# Altium project tanekonsat2022_auto.PrjPcb
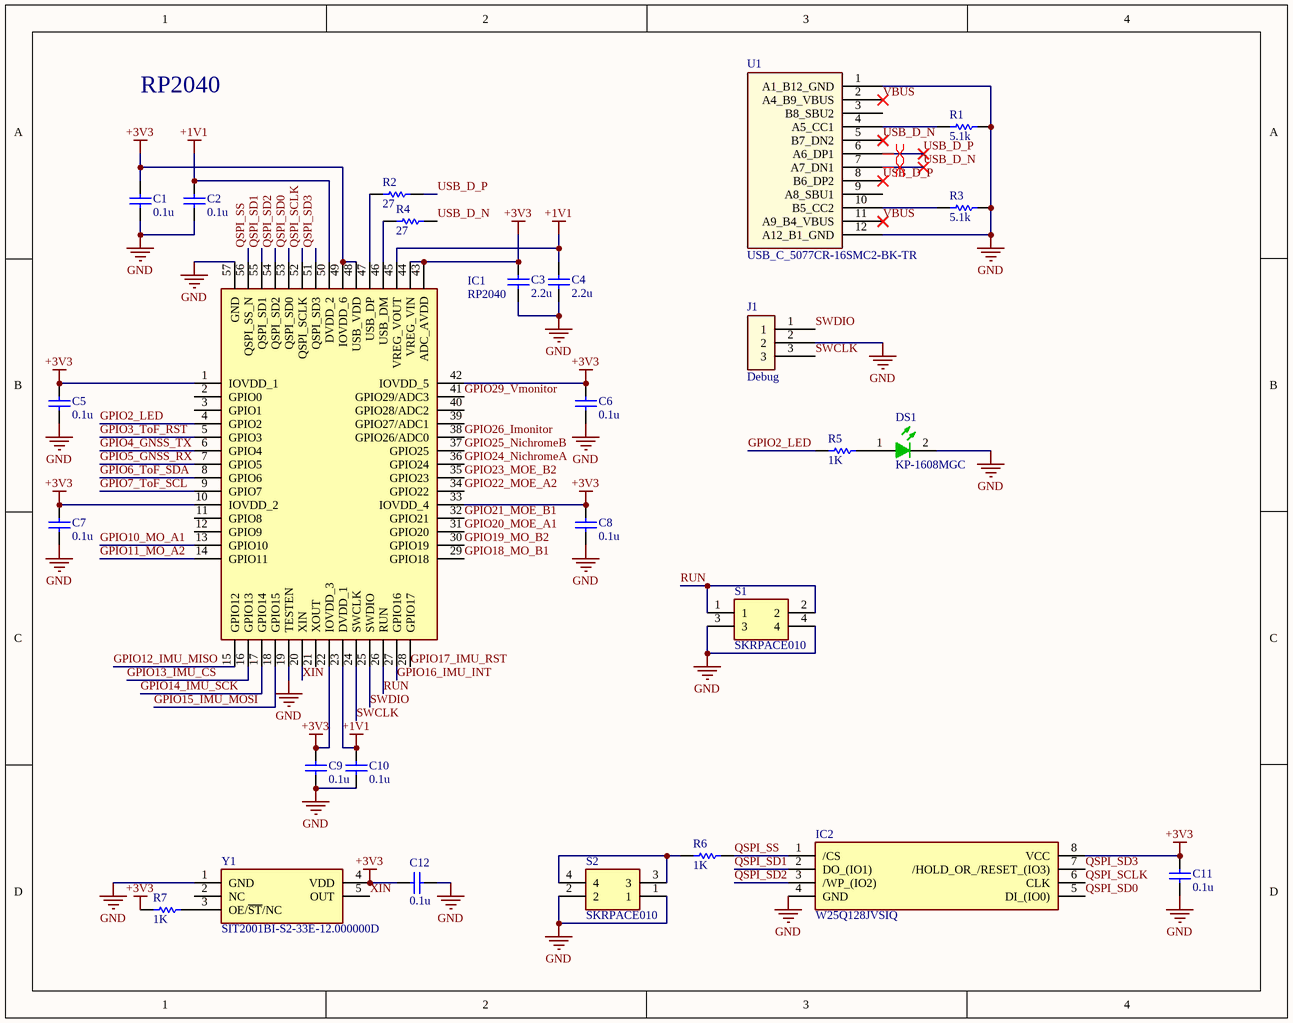
[diagram p0: RP2040_Conn.SchDoc]
3 sheets, 81 parts. Net scope: global (net labels, ports and power ports of the same name join across sheets).
Board file: EM2_PCB.PcbDoc
Sheets:
  RP2040_Conn.SchDoc
  IMU_Motor.SchDoc
  Power_Nichrome.SchDoc

## Sheet RP2040_Conn.SchDoc: Prometheus
size A; DrawnBy: Akio M; Organization: DERC CanSat PJ; Revision: 1; SheetNumber: 1; SheetTotal: 3

### Parts
C1  value 0.1u  [1608[0603]]  (hidden comment: Capacitor)
C2  value 0.1u  [1608[0603]]  (hidden comment: Capacitor)
C3  value 2.2u  [1608[0603]]  (hidden comment: Capacitor)
C4  value 2.2u  [1608[0603]]  (hidden comment: Capacitor)
C5  value 0.1u  [1608[0603]]  (hidden comment: Capacitor)
C6  value 0.1u  [1608[0603]]  (hidden comment: Capacitor)
C7  value 0.1u  [1608[0603]]  (hidden comment: Capacitor)
C8  value 0.1u  [1608[0603]]  (hidden comment: Capacitor)
C9  value 0.1u  [1608[0603]]  (hidden comment: Capacitor)
C10  value 0.1u  [1608[0603]]  (hidden comment: Capacitor)
C11  value 0.1u  [1608[0603]]  (hidden comment: Capacitor)
C12  value 0.1u  [1608[0603]]  (hidden comment: Capacitor)
DS1  KP-1608MGC  [KING-0603LED_GREEN_V]
IC1  RP2040  [QFN40P700X700X90-57N-D]
IC2  W25Q128JVSIQ  [SOIC127P790X216-8N]
J1  Debug  [PinHeader_0.65_3_Half]
R1  value 5.1k  [1608[0603]]  (hidden comment: Resistor)
R2  value 27  [1608[0603]]  (hidden comment: Resistor)
R3  value 5.1k  [1608[0603]]  (hidden comment: Resistor)
R4  value 27  [1608[0603]]  (hidden comment: Resistor)
R5  value 1K  [1608[0603]]  (hidden comment: Resistor)
R6  value 1K  [1608[0603]]  (hidden comment: Resistor)
R7  value 1K  [1608[0603]]  (hidden comment: Resistor)
S1  SKRPACE010  [SMT(4.2X3.2)]
S2  SKRPACE010  [SMT(4.2X3.2)]
U1  USB_C_5077CR-16SMC2-BK-TR  [USB_C_5077CR-16SMC2-BK-TR]
Y1  SIT2001BI-S2-33E-12.000000D  [SOT95P280X145-5N]

### Nets
+1V1: C2.2 C4.2 C10.1 IC1.23(DVDD_1) IC1.45(VREG_VOUT) IC1.50(DVDD_2)
+3V3: C1.2 C3.2 C5.2 C6.1 C7.1 C8.1 C9.1 C11.2 C12.1 IC1.1(IOVDD_1) IC1.10(IOVDD_2) IC1.22(IOVDD_3) IC1.33(IOVDD_4) IC1.42(IOVDD_5) IC1.43(ADC_AVDD) IC1.44(VREG_VIN) IC1.48(USB_VDD) IC1.49(IOVDD_6) IC2.8(VCC) R7.1 Y1.4(VDD)
GND: C1.1 C2.1 C3.1 C4.1 C5.1 C6.2 C7.2 C8.2 C9.2 C10.2 C11.1 C12.2 DS1.2(K) IC1.19(TESTEN) IC1.57(GND) IC2.4(GND) J1.2 R1.2 R3.2 S1.3 S1.4 S2.1 S2.2 U1.1(A1_B12_GND) U1.12(A12_B1_GND) Y1.1(GND)
GPIO2_LED: IC1.4(GPIO2) R5.1
GPIO3_ToF_RST: IC1.5(GPIO3)
GPIO4_GNSS_TX: IC1.6(GPIO4)
GPIO5_GNSS_RX: IC1.7(GPIO5)
GPIO6_ToF_SDA: IC1.8(GPIO6)
GPIO7_ToF_SCL: IC1.9(GPIO7)
GPIO10_MO_A1: IC1.13(GPIO10)
GPIO11_MO_A2: IC1.14(GPIO11)
GPIO12_IMU_MISO: IC1.15(GPIO12)
GPIO13_IMU_CS: IC1.16(GPIO13)
GPIO14_IMU_SCK: IC1.17(GPIO14)
GPIO15_IMU_MOSI: IC1.18(GPIO15)
GPIO16_IMU_INT: IC1.27(GPIO16)
GPIO17_IMU_RST: IC1.28(GPIO17)
GPIO18_MO_B1: IC1.29(GPIO18)
GPIO19_MO_B2: IC1.30(GPIO19)
GPIO20_MOE_A1: IC1.31(GPIO20)
GPIO21_MOE_B1: IC1.32(GPIO21)
GPIO22_MOE_A2: IC1.34(GPIO22)
GPIO23_MOE_B2: IC1.35(GPIO23)
GPIO24_NichromeA: IC1.36(GPIO24)
GPIO25_NichromeB: IC1.37(GPIO25)
GPIO26_Imonitor: IC1.38(GPIO26/ADC0)
GPIO29_Vmonitor: IC1.41(GPIO29/ADC3)
QSPI_SCLK: IC1.52(QSPI_SCLK) IC2.6(CLK)
QSPI_SD0: IC1.53(QSPI_SD0) IC2.5(DI_(IO0))
QSPI_SD1: IC1.55(QSPI_SD1) IC2.2(DO_(IO1))
QSPI_SD2: IC1.54(QSPI_SD2) IC2.3(/WP_(IO2))
QSPI_SD3: IC1.51(QSPI_SD3) IC2.7(/HOLD_OR_/RESET_(IO3))
QSPI_SS: IC1.56(QSPI_SS_N) IC2.1(/CS) R6.2
RUN: IC1.26(RUN) S1.1 S1.2
SWCLK: IC1.24(SWCLK) J1.3
SWDIO: IC1.25(SWDIO) J1.1
USB_D_N: R4.2 U1.5(B7_DN2) U1.7(A7_DN1)
USB_D_P: R2.2 U1.6(A6_DP1) U1.8(B6_DP2)
VBUS: U1.2(A4_B9_VBUS) U1.11(A9_B4_VBUS)
XIN: IC1.20(XIN) Y1.5(OUT)
NetDS1_1: DS1.1(A) R5.2
NetIC1_46: IC1.46(USB_DM) R4.1
NetIC1_47: IC1.47(USB_DP) R2.1
NetR1_1: R1.1 U1.4(A5_CC1)
NetR3_1: R3.1 U1.10(B5_CC2)
NetR6_1: R6.1 S2.3 S2.4
NetR7_2: R7.2 Y1.3(OE/~{ST}/NC)

Not connected (* = marked no-connect by the designer): IC1 2(GPIO0) 3(GPIO1) 11(GPIO8) 12(GPIO9) 21(XOUT) 39(GPIO27/ADC1) 40(GPIO28/ADC2); U1 3(B8_SBU2) 9(A8_SBU1); Y1 2(NC)

### Layout directives
differential pair: USB_D_N, USB_D_P

### Notes on the sheet
- RP2040

### Library data of the parts
C1-C12 = Capacitor: SimulationGenericComponent: True
DS1 = CMP-0404-00001-1: LED, SMT, 0603(1608), 1.1mm thickness, Green; Manufacturer: Kingbright; Reverse Voltage: 5 V; Power Dissipation: 75 mW; Forward Current: 30 mA; Packing Type: 2000 pcs / reel; Mounting Technology: Surface Mount; Storage Temperature: -40 to +85 degC; ComponentLink1URL: http://www.kingbright.com/; PackageDescription: 2-Pin SMT LED, 1.6 x 0.8 mm Pitch; PartNumber: KP-1608MGC; PackageReference: 0603LED_GREEN; ComponentLink1Description: Manufacturer URL
IC1 = RP2040: Integrated Circuit; Manufacturer_Name: RASPBERRY-PI; Datasheet Link: https://datasheets.raspberrypi.org/rp2040/rp2040-datasheet.pdf; Height: 0.9mm; Manufacturer_Part_Number: RP2040
IC2 = W25Q128JVSIQ: Integrated Circuit; Manufacturer_Name: Winbond; Datasheet Link: https://www.winbond.com/hq/search-resource-file.jsp?partNo=W25Q128JVSIQ&type=datasheet; Height: 2.16mm; Manufacturer_Part_Number: W25Q128JVSIQ; Mouser Part Number: 454-W25Q128JVSIQ; Mouser Price/Stock: https://www.mouser.co.uk/ProductDetail/Winbond/W25Q128JVSIQ?qs=qSfuJ%252Bfl%2Fd6tLXvPR4fl9w%3D%3D; Arrow Part Number: W25Q128JVSIQ; Arrow Price/Stock: https://www.arrow.com/en/products/w25q128jvsiq/winbond-electronics?region=nac
J1 = PinHeader_0.65_3_Half
R1-R7 = Resistor: TC1: 0; SimulationGenericComponent: True; TC2: 0
S1 S2 = SKRPACE010: Switch; Manufacturer_Name: ALPS Electric; Datasheet Link: http://www.alps.com/prod/info/E/HTML/Tact/SurfaceMount/SKRP/SKRPACE010.html; Manufacturer_Part_Number: SKRPACE010; Mouser Part Number: 688-SKRPACE010; Mouser Price/Stock: https://www.mouser.co.uk/ProductDetail/Alps-Alpine/SKRPACE010?qs=dHDuPHwQO79W8iY66hDbLQ%3D%3D; Arrow Part Number: SKRPACE010; Arrow Price/Stock: https://www.arrow.com/en/products/skrpace010/alps-electric
Y1 = SIT2001BI-S2-33E-12.000000D: Crystal or Oscillator; Manufacturer_Name: SiTime; Datasheet Link: https://www.sitime.com/datasheet/SiT2001; Height: 1.45mm; Manufacturer_Part_Number: SIT2001BI-S2-33E-12.000000D

## Sheet IMU_Motor.SchDoc
size A; SheetNumber: 2; SheetTotal: 3
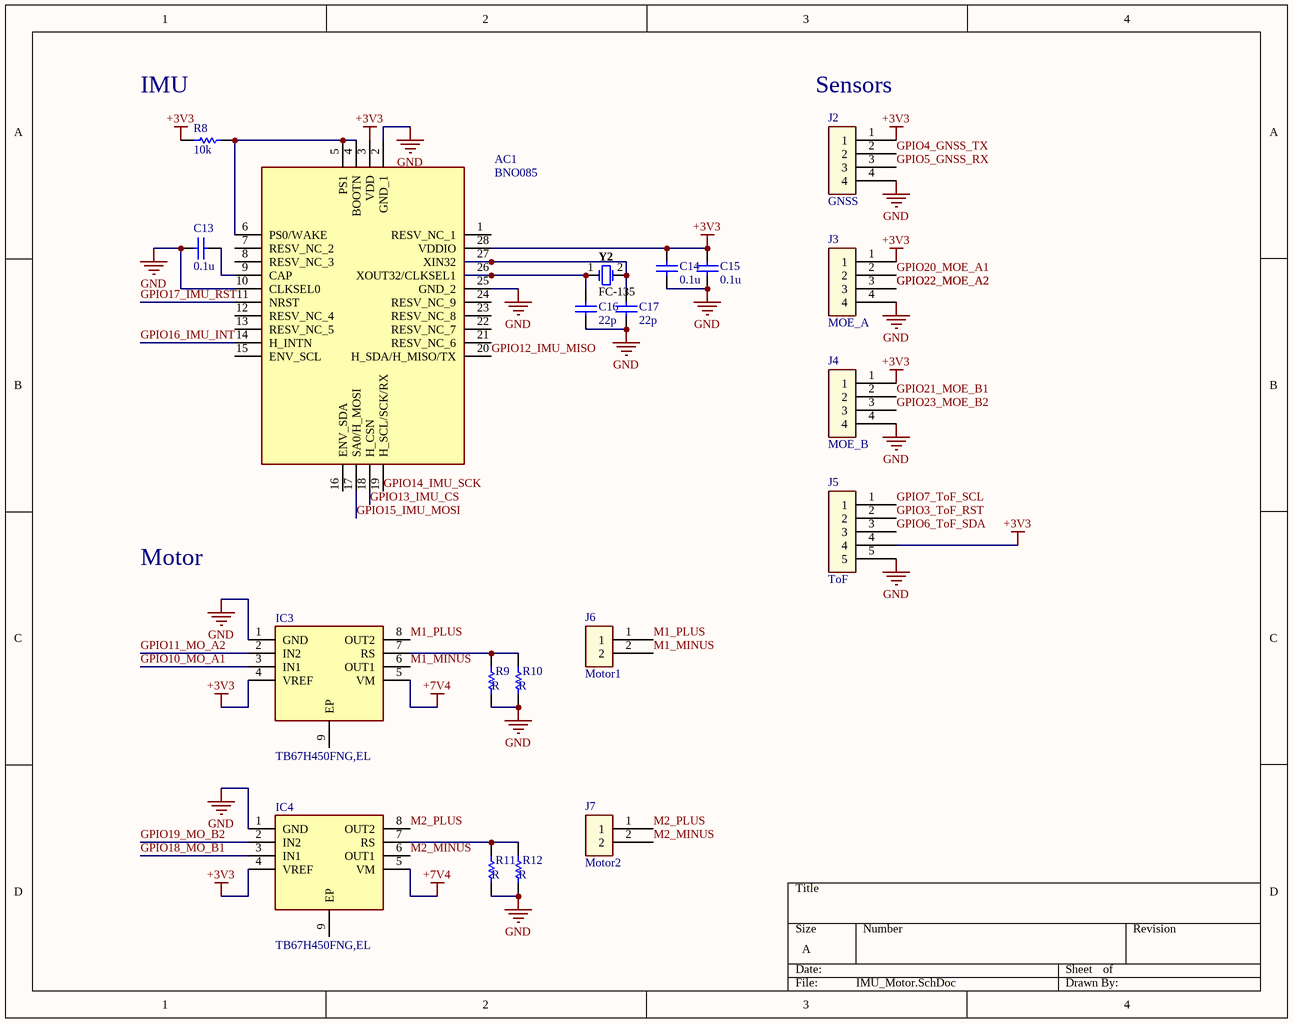
[diagram p1: IMU_Motor.SchDoc]

### Parts
AC1  BNO085  [BNO085]
C13  value 0.1u  [1608[0603]]  (hidden comment: Capacitor)
C14  value 0.1u  [1608[0603]]  (hidden comment: Capacitor)
C15  value 0.1u  [1608[0603]]  (hidden comment: Capacitor)
C16  value 22p  [1608[0603]]  (hidden comment: Capacitor)
C17  value 22p  [1608[0603]]  (hidden comment: Capacitor)
IC3  TB67H450FNG,EL  [SOIC127P600X175-9N]
IC4  TB67H450FNG,EL  [SOIC127P600X175-9N]
J2  GNSS  [PinHeader_2.0_4_SMD]
J3  MOE_A  [PinHeader_2.0_4_SMD]
J4  MOE_B  [PinHeader_2.0_4_SMD]
J5  ToF  [PinHeader_2.0_5_SMD]
J6  Motor1  [PinHeader_2.0_2_SMD]
J7  Motor2  [PinHeader_2.0_2_SMD]
R8  value 10k  [1608[0603]]  (hidden comment: Resistor)
R9  value R  [1608[0603]]  (hidden comment: Resistor)
R10  value R  [1608[0603]]  (hidden comment: Resistor)
R11  value R  [1608[0603]]  (hidden comment: Resistor)
R12  value R  [1608[0603]]  (hidden comment: Resistor)
Y2  FC-135  [EPSON-FC-135_V]

### Nets
+3V3: AC1.3(VDD) AC1.28(VDDIO) C14.2 C15.2 IC3.4(VREF) IC4.4(VREF) J2.1 J3.1 J4.1 J5.4 R8.1
+7V4: IC3.5(VM) IC4.5(VM)
GND: AC1.2(GND_1) AC1.10(CLKSEL0) AC1.25(GND_2) C13.1 C14.1 C15.1 C16.1 C17.1 IC3.1(GND) IC4.1(GND) J2.4 J3.4 J4.4 J5.5 R9.1 R10.1 R11.1 R12.1
GPIO3_ToF_RST: J5.2
GPIO4_GNSS_TX: J2.2
GPIO5_GNSS_RX: J2.3
GPIO6_ToF_SDA: J5.3
GPIO7_ToF_SCL: J5.1
GPIO10_MO_A1: IC3.3(IN1)
GPIO11_MO_A2: IC3.2(IN2)
GPIO12_IMU_MISO: AC1.20(H_SDA/H_MISO/TX)
GPIO13_IMU_CS: AC1.18(H_CSN)
GPIO14_IMU_SCK: AC1.19(H_SCL/SCK/RX)
GPIO15_IMU_MOSI: AC1.17(SA0/H_MOSI)
GPIO16_IMU_INT: AC1.14(H_INTN)
GPIO17_IMU_RST: AC1.11(NRST)
GPIO18_MO_B1: IC4.3(IN1)
GPIO19_MO_B2: IC4.2(IN2)
GPIO20_MOE_A1: J3.2
GPIO21_MOE_B1: J4.2
GPIO22_MOE_A2: J3.3
GPIO23_MOE_B2: J4.3
M1_MINUS: IC3.6(OUT1) J6.2
M1_PLUS: IC3.8(OUT2) J6.1
M2_MINUS: IC4.6(OUT1) J7.2
M2_PLUS: IC4.8(OUT2) J7.1
NetAC1_4: AC1.4(BOOTN) AC1.5(PS1) AC1.6(PS0/WAKE) R8.2
NetAC1_9: AC1.9(CAP) C13.2
NetAC1_26: AC1.26(XOUT32/CLKSEL1) C16.2 Y2.1
NetAC1_27: AC1.27(XIN32) C17.2 Y2.2
NetIC3_7: IC3.7(RS) R9.2 R10.2
NetIC4_7: IC4.7(RS) R11.2 R12.2

Not connected (* = marked no-connect by the designer): AC1 1(RESV_NC_1) 7(RESV_NC_2) 8(RESV_NC_3) 12(RESV_NC_4) 13(RESV_NC_5) 15(ENV_SCL) 16(ENV_SDA) 21(RESV_NC_6) 22(RESV_NC_7) 23(RESV_NC_8) 24(RESV_NC_9); IC3 9(EP); IC4 9(EP)

### Notes on the sheet
- (near R8) IMU
- (near J2) Sensors
- Motor

### Library data of the parts
AC1 = BNO085: Accelerometer; Manufacturer_Name: Hillcrest Laboratories; Datasheet Link: https://www.hillcrestlabs.com/downloads/bno080-datasheet; Height: 1.18mm; Manufacturer_Part_Number: BNO085
C13-C17 = Capacitor: SimulationGenericComponent: True
IC3 IC4 = TB67H450FNG,EL: Integrated Circuit; Manufacturer_Name: Toshiba; Datasheet Link: http://toshiba.semicon-storage.com/info/docget.jsp?did=65346&prodName=TB67H450FNG; Height: 1.75mm; Manufacturer_Part_Number: TB67H450FNG,EL; Mouser Part Number: 757-TB67H450FNGEL; Mouser Price/Stock: https://www.mouser.co.uk/ProductDetail/Toshiba/TB67H450FNGEL?qs=h6V4JsTaLXeReNg2bp0jug%3D%3D; Arrow Part Number: TB67H450FNG,EL; Arrow Price/Stock: https://www.arrow.com/en/products/tb67h450fngel/toshiba?region=nac
J2-J4 = PinHeader_2.0_4_SMD
J5 = PinHeader_2.0_5_SMD
J6 J7 = PinHeader_2.0_2_SMD
R8-R12 = Resistor: TC1: 0; SimulationGenericComponent: True; TC2: 0
Y2 = CMP-2100-03637-1: Crystal Unit, 32 to 77.5 KHz, 0.5 uW, -40 to 85 degC, 2-Pin SMD, RoHS; Manufacturer: Epson; RoHSCompliant: false; Datasheet URL: http://www5.epsondevice.com/en/products/khz_range/fc135r.html#; Datasheet Version: 42036.0; Manufacturer URL: https://www.eea.epson.com/; Package Reference: FC-135; Package Description: 2-Pin Surface Mount Device, Body 3.2 x 1.5 mm

## Sheet Power_Nichrome.SchDoc
size A; SheetNumber: 3; SheetTotal: 3; SPICEModelCacheTJWSCOIJ: <root> / <DocumentId>TJWSCOIJ</DocumentId> / </root>
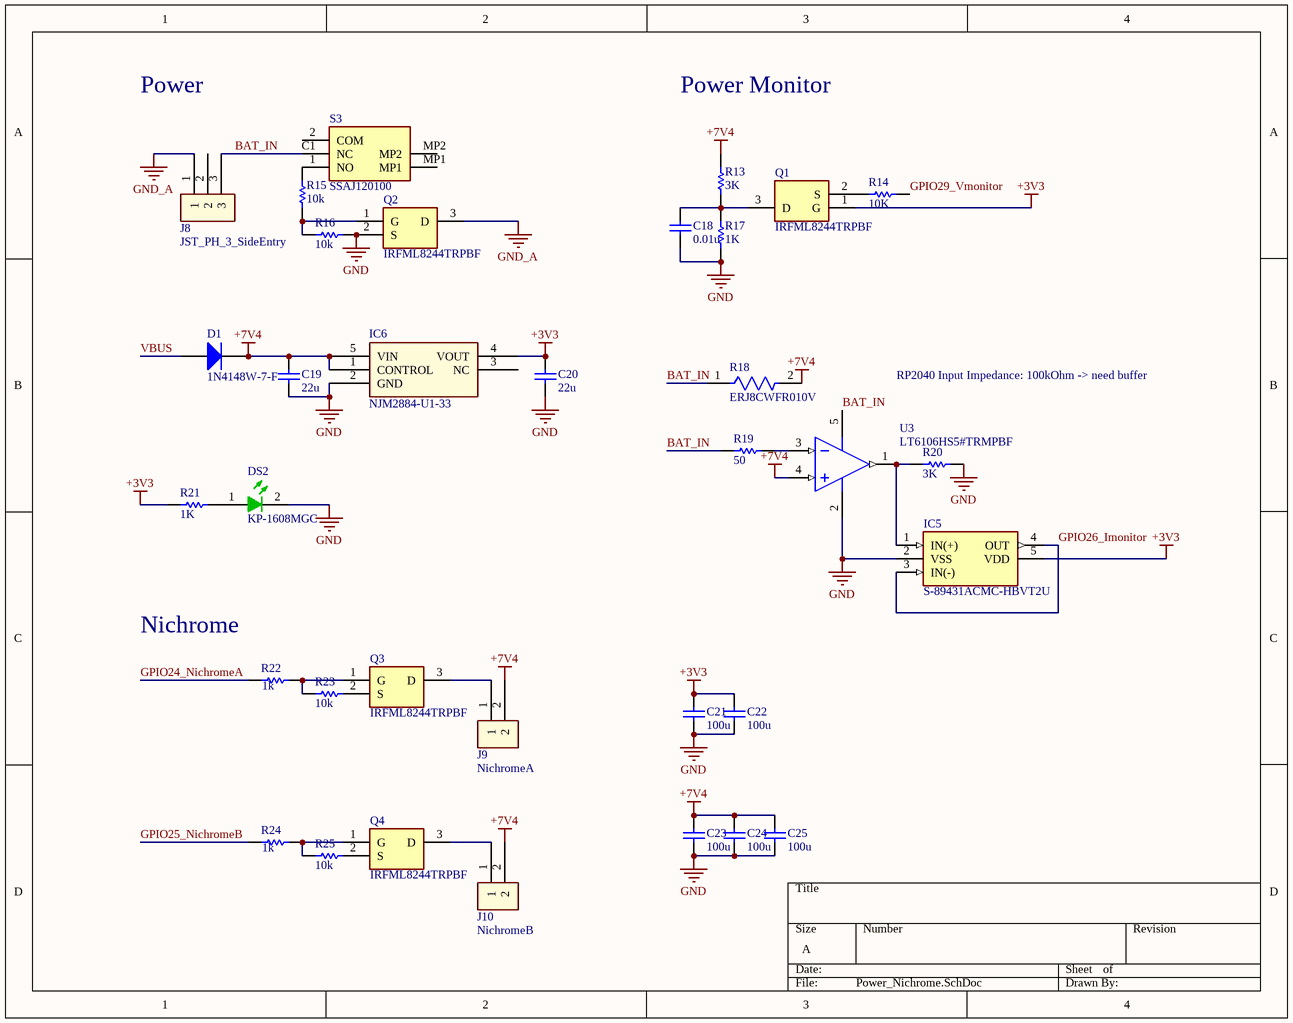
[diagram p2: Power_Nichrome.SchDoc]

### Parts
C18  value 0.01u  [1608[0603]]  (hidden comment: Capacitor)
C19  value 22u  [1608[0603]]  (hidden comment: Capacitor)
C20  value 22u  [1608[0603]]  (hidden comment: Capacitor)
C21  value 100u  [1608[0603]]  (hidden comment: Capacitor)
C22  value 100u  [1608[0603]]  (hidden comment: Capacitor)
C23  value 100u  [1608[0603]]  (hidden comment: Capacitor)
C24  value 100u  [1608[0603]]  (hidden comment: Capacitor)
C25  value 100u  [1608[0603]]  (hidden comment: Capacitor)
D1  1N4148W-7-F  [DIOD-SOD123-2_V]
DS2  KP-1608MGC  [KING-0603LED_GREEN_V]
IC5  S-89431ACMC-HBVT2U  [SOT95P275X130-5N]
IC6  NJM2884-U1-33  [NJM2884-U1-33]
J8  JST_PH_3_SideEntry  [JST_PH_3_SideEntry]
J9  NichromeA  [PinHeader_2.0_2_SMD]
J10  NichromeB  [PinHeader_2.0_2_SMD]
Q1  IRFML8244TRPBF  [SOT95P237X112-3N]
Q2  IRFML8244TRPBF  [SOT95P237X112-3N]
Q3  IRFML8244TRPBF  [SOT95P237X112-3N]
Q4  IRFML8244TRPBF  [SOT95P237X112-3N]
R13  value 3K  [1608[0603]]  (hidden comment: Resistor)
R14  value 10K  [1608[0603]]  (hidden comment: Resistor)
R15  value 10k  [1608[0603]]  (hidden comment: Resistor)
R16  value 10k  [1608[0603]]  (hidden comment: Resistor)
R17  value 1K  [1608[0603]]  (hidden comment: Resistor)
R18  ERJ8CWFR010V  [FP-ERJ8CW-MFG]
R19  value 50  [1608[0603]]  (hidden comment: Resistor)
R20  value 3K  [1608[0603]]  (hidden comment: Resistor)
R21  value 1K  [1608[0603]]  (hidden comment: Resistor)
R22  value 1k  [1608[0603]]  (hidden comment: Resistor)
R23  value 10k  [1608[0603]]  (hidden comment: Resistor)
R24  value 1k  [1608[0603]]  (hidden comment: Resistor)
R25  value 10k  [1608[0603]]  (hidden comment: Resistor)
S3  SSAJ120100  [SSAJ120100]
U3  LT6106HS5#TRMPBF  [LT-S5-5-TSOT-23_N]

### Nets
+3V3: C20.2 C21.2 C22.2 IC5.5(VDD) IC6.4(VOUT) Q1.1(G) R21.1
+7V4: C19.2 C23.2 C24.2 C25.2 D1.2(K) IC6.1(CONTROL) IC6.5(VIN) J9.2 J10.2 R13.2 R18.2 U3.4(+IN)
GND: C18.2 C19.1 C20.1 C21.1 C22.1 C23.1 C24.1 C25.1 DS2.2(K) IC5.2(VSS) IC6.2(GND) Q2.2(S) R16.1 R17.1 R20.2 U3.2(V-)
GND_A: J8.1 Q2.3(D)
BAT_IN: J8.3 R18.1 R19.1 S3.C1(NC) U3.5(V+)
GPIO24_NichromeA: R22.1
GPIO25_NichromeB: R24.1
GPIO26_Imonitor: IC5.3(IN(-)) IC5.4(OUT)
GPIO29_Vmonitor: R14.2
VBUS: D1.1(A)
NetC18_1: C18.1 Q1.3(D) R13.1 R17.2
NetDS2_1: DS2.1(A) R21.2
NetIC5_1: IC5.1(IN(+)) R20.1 U3.1(OUT)
NetJ9_1: J9.1 Q3.3(D)
NetJ10_1: J10.1 Q4.3(D)
NetQ1_2: Q1.2(S) R14.1
NetQ2_1: Q2.1(G) R15.2 R16.2
NetQ3_1: Q3.1(G) R22.2 R23.1
NetQ4_1: Q4.1(G) R24.2 R25.1
NetR15_1: R15.1 S3.1(NO)
NetR19_2: R19.2 U3.3(-IN)

Not connected (* = marked no-connect by the designer): IC6 3(NC); J8 2; Q3 2(S); Q4 2(S); R23 2; R25 2; S3 2(COM) MP1 MP2

### Notes on the sheet
- Power
- Power Monitor
- RP2040 Input Impedance: 100kOhm -> need buffer
- (near R22) Nichrome

### Library data of the parts
C18-C25 = Capacitor: SimulationGenericComponent: True
D1 = CMP-2000-04932-2: Fast Switching Diode, 100 V, 0.15 A, -65 to 150 degC, 2-Pin?SOD123, RoHS, Tape and Reel; Recovery Time: 4ns; Brand: DiodesIncorporated; Unit Weight: 0.000353oz; Max Surge Current: 2A; Peak Reverse Voltage: 100V; Ir - Reverse Current: 1uA; Vf - Forward Voltage: 1.25V; Configuration: Single; If - Forward Current: 0.15A; Product Category: Diodes-GeneralPurpose,Power,Switching; Operating Temperature Range: -65Cto+150C; Packaging: Reel; Manufacturer URL: http://www.diodes.com/; Maximum Operating Temperature: +150C; Height: 1.25mm; Minimum Operating Temperature: -65C; Product: SwitchingDiodes; Package URL: http://www.diodes.com/datasheets/ds18004.pdf; Type: SwitchingDiode; Package Reference: SOD123-2; Width: 1.7mm; Datasheet URL: http://www.farnell.com/datasheets/1915529.pdf; Datasheet Version: Rev. 24-2, 10/2013; Series: 1N4148; Factory Pack Quantity: 3000; Length: 2.85mm; RoHS: True; Manufacturer: DiodesIncorporated; Mounting Style: SMD/SMT; Package / Case: SOD-123
DS2 = CMP-0404-00001-1: as DS1 on sheet RP2040_Conn; Mounting Technology: Surface Mount; Storage Temperature: -40 to +85 degC; ComponentLink1URL: http://www.kingbright.com/; PackageDescription: 2-Pin SMT LED, 1.6 x 0.8 mm Pitch; PartNumber: KP-1608MGC; PackageReference: 0603LED_GREEN; ComponentLink1Description: Manufacturer URL
IC5 = S-89431ACMC-HBVT2U: Integrated Circuit; Manufacturer_Name: ABLIC Inc.; Datasheet Link: https://datasheet.datasheetarchive.com/originals/distributors/DKDS-7/134209.pdf; Height: 1.3mm; Manufacturer_Part_Number: S-89431ACMC-HBVT2U; Mouser Part Number: 628-S89431ACMCHBVT2G; Mouser Price/Stock: https://www.mouser.co.uk/ProductDetail/ABLIC/S-89431ACMC-HBVT2U/?qs=sE1HjTVAc2jFUPQ1oZ8CUg%3D%3D
J9 J10 = PinHeader_2.0_2_SMD
Q1-Q4 = IRFML8244TRPBF: Transistor; Manufacturer_Name: Infineon; Datasheet Link: http://www.infineon.com/dgdl/irfml8244pbf.pdf?fileId=5546d462533600a40153562817c91fc0; Height: 1.12mm; Manufacturer_Part_Number: IRFML8244TRPBF; Mouser Part Number: 942-IRFML8244TRPBF; Mouser Price/Stock: https://www.mouser.co.uk/ProductDetail/Infineon-IR/IRFML8244TRPBF?qs=9%252BKlkBgLFf0%252B01xOpCf7sA%3D%3D; Arrow Part Number: IRFML8244TRPBF; Arrow Price/Stock: https://www.arrow.com/en/products/irfml8244trpbf/infineon-technologies-ag
R13-R17 R19-R25 = Resistor: TC1: 0; SimulationGenericComponent: True; TC2: 0
R18 = CMP-2003-00786-2: RES 0.01 OHM 1% 1W 1206; Temperature Coefficient: 75ppm/°C; Resistance: 10mR; Military Standard: Not; Depth: 1.6mm; Mount: Surface Mount; Resistor Type: Thick Film; Termination: Flat; Features: Automotive AEC-Q200; Number of Terminations: 2; Max Power Dissipation: 1W; Tolerance: 1%; Case Code (Imperial): 1206; Max Operating Temperature: 125°C; Case Code (Metric): 3216; Lead Free: Lead Free; Case/Package: 1206; Power Rating: 1W; Width: 0.063inch; Packaging: Cut Tape; Length: 3.2mm; Height: 0.03inch; REACH SVHC: No SVHC; Min Operating Temperature: -55°C
S3 = SSAJ120100: Switch; Manufacturer_Name: ALPS Electric; Datasheet Link: https://www.mouser.jp/datasheet/2/15/SSAJ-1370983.pdf; Height: 0.7mm; Manufacturer_Part_Number: SSAJ120100; Mouser Part Number: 688-SSAJ120100; Mouser Price/Stock: https://www.mouser.co.uk/ProductDetail/Alps-Alpine/SSAJ120100?qs=35GPJvxY%252Bl5mRNwFoBrl2g%3D%3D
U3 = CMP-0359-01868-2: Single Channel, Low Cost, High Side Current Sense Operational Amplifier, 0.2 MHz Typical GBW, 5-Pin SOT-23 (S5-5), High Temperature / Automotive, Pb-Free, Mini Reel; Manufacturer: Linear Technology; Linear Technology Part Number: LT6106; Is (mA) Typical: 0.06; Vs Min (V): 2.7; Vos (mV) Typical: 0.15; Vs Max (V): 36; Vos (mV) Guaranteed: 0.25; GBW (MHz) Typical: 0.2; Channels (#): 1; Packing: Mini Reel; Code_JEDEC: MO-193; Type: CSA; ComponentLink1Description: Manufacturer URL; ComponentLink3URL: http://cds.linear.com/docs/en/packaging/SOT_5_05-08-1635.pdf; ComponentLink3Description: Package Specification; PackageDescription: 5-Lead Plastic TSOT-23, Body 1.63 x 2.90 mm, Pitch 0.95 mm; DatasheetVersion: Rev. A; RevisionNote: URLs updated; PackageReference: LT-S5-5-TSOT-23; Mounting Technology: Surface Mount; RoHS: Pb-Free; ComponentLink2Description: Datasheet; PartNumber: LT6106HS5#TRMPBF; ComponentLink1URL: http://www.linear.com/; ComponentLink2URL: http://cds.linear.com/docs/en/datasheet/6106fa.pdf

## Nets that join several sheets
+3V3: RP2040_Conn (21 pins), IMU_Motor (11 pins), Power_Nichrome (7 pins)
+7V4: IMU_Motor (IC3.5 IC4.5), Power_Nichrome (12 pins)
GND: RP2040_Conn (26 pins), IMU_Motor (18 pins), Power_Nichrome (16 pins)
GPIO3_ToF_RST: RP2040_Conn (IC1.5), IMU_Motor (J5.2)
GPIO4_GNSS_TX: RP2040_Conn (IC1.6), IMU_Motor (J2.2)
GPIO5_GNSS_RX: RP2040_Conn (IC1.7), IMU_Motor (J2.3)
GPIO6_ToF_SDA: RP2040_Conn (IC1.8), IMU_Motor (J5.3)
GPIO7_ToF_SCL: RP2040_Conn (IC1.9), IMU_Motor (J5.1)
GPIO10_MO_A1: RP2040_Conn (IC1.13), IMU_Motor (IC3.3)
GPIO11_MO_A2: RP2040_Conn (IC1.14), IMU_Motor (IC3.2)
GPIO12_IMU_MISO: RP2040_Conn (IC1.15), IMU_Motor (AC1.20)
GPIO13_IMU_CS: RP2040_Conn (IC1.16), IMU_Motor (AC1.18)
GPIO14_IMU_SCK: RP2040_Conn (IC1.17), IMU_Motor (AC1.19)
GPIO15_IMU_MOSI: RP2040_Conn (IC1.18), IMU_Motor (AC1.17)
GPIO16_IMU_INT: RP2040_Conn (IC1.27), IMU_Motor (AC1.14)
GPIO17_IMU_RST: RP2040_Conn (IC1.28), IMU_Motor (AC1.11)
GPIO18_MO_B1: RP2040_Conn (IC1.29), IMU_Motor (IC4.3)
GPIO19_MO_B2: RP2040_Conn (IC1.30), IMU_Motor (IC4.2)
GPIO20_MOE_A1: RP2040_Conn (IC1.31), IMU_Motor (J3.2)
GPIO21_MOE_B1: RP2040_Conn (IC1.32), IMU_Motor (J4.2)
GPIO22_MOE_A2: RP2040_Conn (IC1.34), IMU_Motor (J3.3)
GPIO23_MOE_B2: RP2040_Conn (IC1.35), IMU_Motor (J4.3)
GPIO24_NichromeA: RP2040_Conn (IC1.36), Power_Nichrome (R22.1)
GPIO25_NichromeB: RP2040_Conn (IC1.37), Power_Nichrome (R24.1)
GPIO26_Imonitor: RP2040_Conn (IC1.38), Power_Nichrome (IC5.3 IC5.4)
GPIO29_Vmonitor: RP2040_Conn (IC1.41), Power_Nichrome (R14.2)
VBUS: RP2040_Conn (U1.2 U1.11), Power_Nichrome (D1.1)